# Altium schematic sheet core_module.SchDoc
size A3
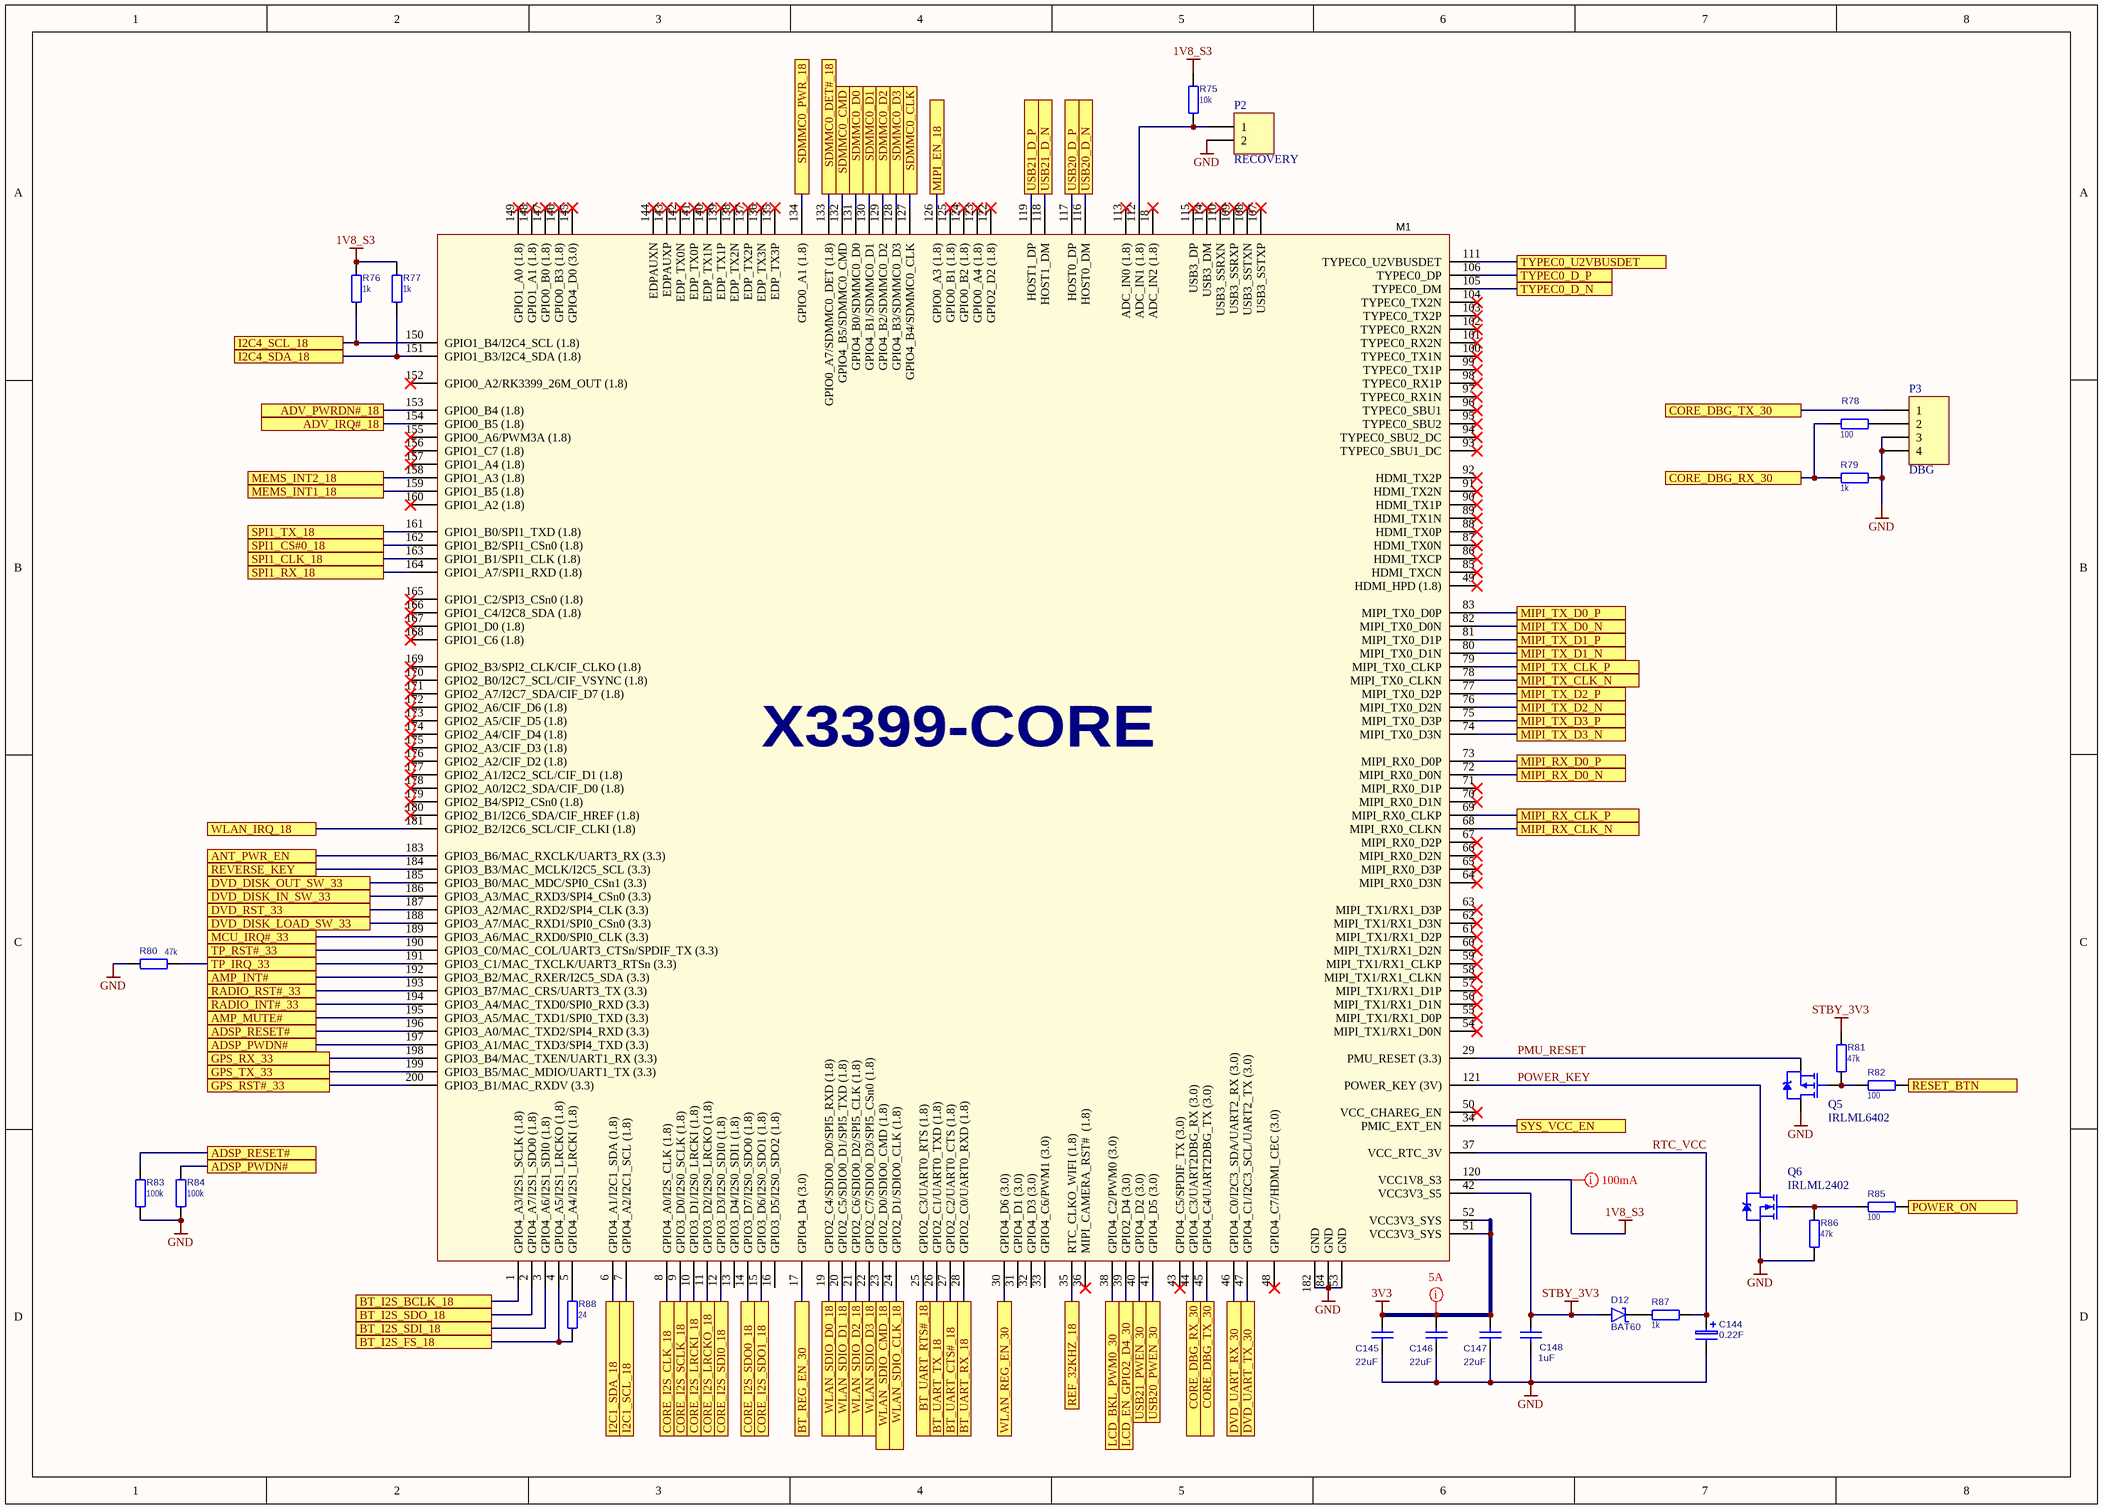
[diagram p0: core_module.SchDoc]

## Parts
C144  0.22F  [DS/DSK]
C145  value 22uF  [C0805]  (hidden comment: CL21A226MQQNNNE)
C146  value 22uF  [C0805]  (hidden comment: CL21A226MQQNNNE)
C147  value 22uF  [C0805]  (hidden comment: CL21A226MQQNNNE)
C148  value 1uF  [C0603]  (hidden comment: CC0603KRX7R9BB105)
D12  value BAT60  [SOD-323]  (hidden comment: BAT60AE6327HTSA1)
M1  X3399-CORE  [X3399-CORE]  (value not drawn)
P2  RECOVERY  [PLS-2]
P3  DBG  [PLD-2]
Q5  IRLML6402  [SOT-23-3]
Q6  IRLML2402  [SOT-23-3]
R75  10k  [R0603]
R76  1k  [R0603]
R77  1k  [R0603]
R78  100  [R0603]
R79  1k  [R0603]
R80  47k  [R0603]
R81  47k  [R0603]
R82  100  [R0603]
R83  100k  [R0603]
R84  100k  [R0603]
R85  100  [R0603]
R86  47k  [R0603]
R87  1k  [R0603]
R88  24  [R0603]

## Ports
ADSP_PWDN#, ADSP_RESET#, ADV_IRQ#_18, ADV_PWRDN#_18, AMP_INT#, AMP_MUTE#, ANT_PWR_EN, BT_I2S_BCLK_18, BT_I2S_FS_18, BT_I2S_SDI_18, BT_I2S_SDO_18, BT_REG_EN_30, BT_UART_CTS#_18, BT_UART_RTS#_18, BT_UART_RX_18, BT_UART_TX_18, CORE_DBG_RX_30, CORE_DBG_TX_30, CORE_I2S_CLK_18, CORE_I2S_LRCKI_18, CORE_I2S_LRCKO_18, CORE_I2S_SCLK_18, CORE_I2S_SDI0_18, CORE_I2S_SDO0_18, CORE_I2S_SDO1_18, DVD_DISK_IN_SW_33, DVD_DISK_LOAD_SW_33, DVD_DISK_OUT_SW_33, DVD_RST_33, DVD_UART_RX_30, DVD_UART_TX_30, GPS_RST#_33, GPS_RX_33, GPS_TX_33, I2C1_SCL_18, I2C1_SDA_18, I2C4_SCL_18, I2C4_SDA_18, LCD_BKL_PWM0_30, LCD_EN_GPIO2_D4_30, MCU_IRQ#_33, MEMS_INT1_18, MEMS_INT2_18, MIPI_EN_18, MIPI_RX_CLK_N, MIPI_RX_CLK_P, MIPI_RX_D0_N, MIPI_RX_D0_P, MIPI_TX_CLK_N, MIPI_TX_CLK_P, MIPI_TX_D0_N, MIPI_TX_D0_P, MIPI_TX_D1_N, MIPI_TX_D1_P, MIPI_TX_D2_N, MIPI_TX_D2_P, MIPI_TX_D3_N, MIPI_TX_D3_P, POWER_ON, RADIO_INT#_33, RADIO_RST#_33, REF_32KHZ_18, RESET_BTN, REVERSE_KEY, SDMMC0_CLK, SDMMC0_CMD, SDMMC0_D0, SDMMC0_D1, SDMMC0_D2, SDMMC0_D3, SDMMC0_DET#_18, SDMMC0_PWR_18, SPI1_CLK_18, SPI1_CS#0_18, SPI1_RX_18, SPI1_TX_18, SYS_VCC_EN, TP_IRQ_33, TP_RST#_33, TYPEC0_D_N, TYPEC0_D_P, TYPEC0_U2VBUSDET, USB20_D_N, USB20_D_P, USB20_PWEN_30, USB21_D_N, USB21_D_P, USB21_PWEN_30, WLAN_IRQ_18, WLAN_REG_EN_30, WLAN_SDIO_CLK_18, WLAN_SDIO_CMD_18, WLAN_SDIO_D0_18, WLAN_SDIO_D1_18, WLAN_SDIO_D2_18, WLAN_SDIO_D3_18

## Nets
1V8_S3: M1.120(VCC1V8_S3) R75.2 R76.2 R77.1
3V3: C145.1 C146.1 C147.1 M1.51(VCC3V3_SYS) M1.52(VCC3V3_SYS)
GND: C144.2(-) C145.2 C146.2 C147.2 C148.1 M1.53(GND) M1.84(GND) M1.182(GND) P2.2 P3.3 P3.4 Q5.3(D) Q6.2(S) R79.2 R80.1 R83.2 R84.2 R86.2
STBY_3V3: C148.2 D12.1(A) M1.42(VCC3V3_S5) R81.1
ADSP_PWDN#: M1.197(GPIO3_A1/MAC_TXD3/SPI4_TXD_(3.3)) R84.1 ; port ADSP_PWDN#
ADSP_RESET#: M1.196(GPIO3_A0/MAC_TXD2/SPI4_RXD_(3.3)) R83.1 ; port ADSP_RESET#
ADV_IRQ#_18: M1.154(GPIO0_B5_(1.8)) ; port ADV_IRQ#_18
ADV_PWRDN#_18: M1.153(GPIO0_B4_(1.8)) ; port ADV_PWRDN#_18
AMP_INT#: M1.192(GPIO3_B2/MAC_RXER/I2C5_SDA_(3.3)) ; port AMP_INT#
AMP_MUTE#: M1.195(GPIO3_A5/MAC_TXD1/SPI0_TXD_(3.3)) ; port AMP_MUTE#
ANT_PWR_EN: M1.183(GPIO3_B6/MAC_RXCLK/UART3_RX_(3.3)) ; port ANT_PWR_EN
BT_I2S_BCLK_18: M1.1(GPIO4_A3/I2S1_SCLK_(1.8)) ; port BT_I2S_BCLK_18
BT_I2S_FS_18: M1.4(GPIO4_A5/I2S1_LRCKO_(1.8)) R88.2 ; port BT_I2S_FS_18
BT_I2S_SDI_18: M1.3(GPIO4_A6/I2S1_SDI0_(1.8)) ; port BT_I2S_SDI_18
BT_I2S_SDO_18: M1.2(GPIO4_A7/I2S1_SDO0_(1.8)) ; port BT_I2S_SDO_18
BT_REG_EN_30: M1.17(GPIO4_D4_(3.0)) ; port BT_REG_EN_30
BT_UART_CTS#_18: M1.27(GPIO2_C2/UART0_CTS_(1.8)) ; port BT_UART_CTS#_18
BT_UART_RTS#_18: M1.25(GPIO2_C3/UART0_RTS_(1.8)) ; port BT_UART_RTS#_18
BT_UART_RX_18: M1.28(GPIO2_C0/UART0_RXD_(1.8)) ; port BT_UART_RX_18
BT_UART_TX_18: M1.26(GPIO2_C1/UART0_TXD_(1.8)) ; port BT_UART_TX_18
CORE_DBG_RX_30: M1.44(GPIO4_C3/UART2DBG_RX_(3.0)) R78.2 R79.1 ; port CORE_DBG_RX_30
CORE_DBG_TX_30: M1.45(GPIO4_C4/UART2DBG_TX_(3.0)) P3.1 ; port CORE_DBG_TX_30
CORE_I2S_CLK_18: M1.8(GPIO4_A0/I2S_CLK_(1.8)) ; port CORE_I2S_CLK_18
CORE_I2S_LRCKI_18: M1.10(GPIO3_D1/I2S0_LRCKI_(1.8)) ; port CORE_I2S_LRCKI_18
CORE_I2S_LRCKO_18: M1.11(GPIO3_D2/I2S0_LRCKO_(1.8)) ; port CORE_I2S_LRCKO_18
CORE_I2S_SCLK_18: M1.9(GPIO3_D0/I2S0_SCLK_(1.8)) ; port CORE_I2S_SCLK_18
CORE_I2S_SDI0_18: M1.12(GPIO3_D3/I2S0_SDI0_(1.8)) ; port CORE_I2S_SDI0_18
CORE_I2S_SDO0_18: M1.14(GPIO3_D7/I2S0_SDO0_(1.8)) ; port CORE_I2S_SDO0_18
CORE_I2S_SDO1_18: M1.15(GPIO3_D6/I2S0_SDO1_(1.8)) ; port CORE_I2S_SDO1_18
DVD_DISK_IN_SW_33: M1.186(GPIO3_A3/MAC_RXD3/SPI4_CSn0_(3.3)) ; port DVD_DISK_IN_SW_33
DVD_DISK_LOAD_SW_33: M1.188(GPIO3_A7/MAC_RXD1/SPI0_CSn0_(3.3)) ; port DVD_DISK_LOAD_SW_33
DVD_DISK_OUT_SW_33: M1.185(GPIO3_B0/MAC_MDC/SPI0_CSn1_(3.3)) ; port DVD_DISK_OUT_SW_33
DVD_RST_33: M1.187(GPIO3_A2/MAC_RXD2/SPI4_CLK_(3.3)) ; port DVD_RST_33
DVD_UART_RX_30: M1.46(GPIO4_C0/I2C3_SDA/UART2_RX_(3.0)) ; port DVD_UART_RX_30
DVD_UART_TX_30: M1.47(GPIO4_C1/I2C3_SCL/UART2_TX_(3.0)) ; port DVD_UART_TX_30
GPS_RST#_33: M1.200(GPIO3_B1/MAC_RXDV_(3.3)) ; port GPS_RST#_33
GPS_RX_33: M1.198(GPIO3_B4/MAC_TXEN/UART1_RX_(3.3)) ; port GPS_RX_33
GPS_TX_33: M1.199(GPIO3_B5/MAC_MDIO/UART1_TX_(3.3)) ; port GPS_TX_33
I2C1_SCL_18: M1.7(GPIO4_A2/I2C1_SCL_(1.8)) ; port I2C1_SCL_18
I2C1_SDA_18: M1.6(GPIO4_A1/I2C1_SDA_(1.8)) ; port I2C1_SDA_18
I2C4_SCL_18: M1.150(GPIO1_B4/I2C4_SCL_(1.8)) R76.1 ; port I2C4_SCL_18
I2C4_SDA_18: M1.151(GPIO1_B3/I2C4_SDA_(1.8)) R77.2 ; port I2C4_SDA_18
LCD_BKL_PWM0_30: M1.38(GPIO4_C2/PWM0_(3.0)) ; port LCD_BKL_PWM0_30
LCD_EN_GPIO2_D4_30: M1.39(GPIO2_D4_(3.0)) ; port LCD_EN_GPIO2_D4_30
MCU_IRQ#_33: M1.189(GPIO3_A6/MAC_RXD0/SPI0_CLK_(3.3)) ; port MCU_IRQ#_33
MEMS_INT1_18: M1.159(GPIO1_B5_(1.8)) ; port MEMS_INT1_18
MEMS_INT2_18: M1.158(GPIO1_A3_(1.8)) ; port MEMS_INT2_18
MIPI_EN_18: M1.126(GPIO0_A3_(1.8)) ; port MIPI_EN_18
MIPI_RX_CLK_N: M1.68(MIPI_RX0_CLKN) ; port MIPI_RX_CLK_N
MIPI_RX_CLK_P: M1.69(MIPI_RX0_CLKP) ; port MIPI_RX_CLK_P
MIPI_RX_D0_N: M1.72(MIPI_RX0_D0N) ; port MIPI_RX_D0_N
MIPI_RX_D0_P: M1.73(MIPI_RX0_D0P) ; port MIPI_RX_D0_P
MIPI_TX_CLK_N: M1.78(MIPI_TX0_CLKN) ; port MIPI_TX_CLK_N
MIPI_TX_CLK_P: M1.79(MIPI_TX0_CLKP) ; port MIPI_TX_CLK_P
MIPI_TX_D0_N: M1.82(MIPI_TX0_D0N) ; port MIPI_TX_D0_N
MIPI_TX_D0_P: M1.83(MIPI_TX0_D0P) ; port MIPI_TX_D0_P
MIPI_TX_D1_N: M1.80(MIPI_TX0_D1N) ; port MIPI_TX_D1_N
MIPI_TX_D1_P: M1.81(MIPI_TX0_D1P) ; port MIPI_TX_D1_P
MIPI_TX_D2_N: M1.76(MIPI_TX0_D2N) ; port MIPI_TX_D2_N
MIPI_TX_D2_P: M1.77(MIPI_TX0_D2P) ; port MIPI_TX_D2_P
MIPI_TX_D3_N: M1.74(MIPI_TX0_D3N) ; port MIPI_TX_D3_N
MIPI_TX_D3_P: M1.75(MIPI_TX0_D3P) ; port MIPI_TX_D3_P
PMU_RESET: M1.29(PMU_RESET_(3.3)) Q5.2(S)
POWER_KEY: M1.121(POWER_KEY_(3V)) Q6.3(D)
POWER_ON: R85.1 ; port POWER_ON
RADIO_INT#_33: M1.194(GPIO3_A4/MAC_TXD0/SPI0_RXD_(3.3)) ; port RADIO_INT#_33
RADIO_RST#_33: M1.193(GPIO3_B7/MAC_CRS/UART3_TX_(3.3)) ; port RADIO_RST#_33
REF_32KHZ_18: M1.35(RTC_CLKO_WIFI_(1.8)) ; port REF_32KHZ_18
RESET_BTN: R82.1 ; port RESET_BTN
REVERSE_KEY: M1.184(GPIO3_B3/MAC_MCLK/I2C5_SCL_(3.3)) ; port REVERSE_KEY
RTC_VCC: C144.1(+) M1.37(VCC_RTC_3V) R87.1
SDMMC0_CLK: M1.127(GPIO4_B4/SDMMC0_CLK) ; port SDMMC0_CLK
SDMMC0_CMD: M1.132(GPIO4_B5/SDMMC0_CMD) ; port SDMMC0_CMD
SDMMC0_D0: M1.131(GPIO4_B0/SDMMC0_D0) ; port SDMMC0_D0
SDMMC0_D1: M1.130(GPIO4_B1/SDMMC0_D1) ; port SDMMC0_D1
SDMMC0_D2: M1.129(GPIO4_B2/SDMMC0_D2) ; port SDMMC0_D2
SDMMC0_D3: M1.128(GPIO4_B3/SDMMC0_D3) ; port SDMMC0_D3
SDMMC0_DET#_18: M1.133(GPIO0_A7/SDMMC0_DET_(1.8)) ; port SDMMC0_DET#_18
SDMMC0_PWR_18: M1.134(GPIO0_A1_(1.8)) ; port SDMMC0_PWR_18
SPI1_CLK_18: M1.163(GPIO1_B1/SPI1_CLK_(1.8)) ; port SPI1_CLK_18
SPI1_CS#0_18: M1.162(GPIO1_B2/SPI1_CSn0_(1.8)) ; port SPI1_CS#0_18
SPI1_RX_18: M1.164(GPIO1_A7/SPI1_RXD_(1.8)) ; port SPI1_RX_18
SPI1_TX_18: M1.161(GPIO1_B0/SPI1_TXD_(1.8)) ; port SPI1_TX_18
SYS_VCC_EN: M1.34(PMIC_EXT_EN) ; port SYS_VCC_EN
TP_IRQ_33: M1.191(GPIO3_C1/MAC_TXCLK/UART3_RTSn_(3.3)) R80.2 ; port TP_IRQ_33
TP_RST#_33: M1.190(GPIO3_C0/MAC_COL/UART3_CTSn/SPDIF_TX_(3.3)) ; port TP_RST#_33
TYPEC0_D_N: M1.105(TYPEC0_DM) ; port TYPEC0_D_N
TYPEC0_D_P: M1.106(TYPEC0_DP) ; port TYPEC0_D_P
TYPEC0_U2VBUSDET: M1.111(TYPEC0_U2VBUSDET) ; port TYPEC0_U2VBUSDET
USB20_D_N: M1.116(HOST0_DM) ; port USB20_D_N
USB20_D_P: M1.117(HOST0_DP) ; port USB20_D_P
USB20_PWEN_30: M1.41(GPIO4_D5_(3.0)) ; port USB20_PWEN_30
USB21_D_N: M1.118(HOST1_DM) ; port USB21_D_N
USB21_D_P: M1.119(HOST1_DP) ; port USB21_D_P
USB21_PWEN_30: M1.40(GPIO4_D2_(3.0)) ; port USB21_PWEN_30
WLAN_IRQ_18: M1.181(GPIO2_B2/I2C6_SCL/CIF_CLKI_(1.8)) ; port WLAN_IRQ_18
WLAN_REG_EN_30: M1.30(GPIO4_D6_(3.0)) ; port WLAN_REG_EN_30
WLAN_SDIO_CLK_18: M1.24(GPIO2_D1/SDIO0_CLK_(1.8)) ; port WLAN_SDIO_CLK_18
WLAN_SDIO_CMD_18: M1.23(GPIO2_D0/SDIO0_CMD_(1.8)) ; port WLAN_SDIO_CMD_18
WLAN_SDIO_D0_18: M1.19(GPIO2_C4/SDIO0_D0/SPI5_RXD_(1.8)) ; port WLAN_SDIO_D0_18
WLAN_SDIO_D1_18: M1.20(GPIO2_C5/SDIO0_D1/SPI5_TXD_(1.8)) ; port WLAN_SDIO_D1_18
WLAN_SDIO_D2_18: M1.21(GPIO2_C6/SDIO0_D2/SPI5_CLK_(1.8)) ; port WLAN_SDIO_D2_18
WLAN_SDIO_D3_18: M1.22(GPIO2_C7/SDIO0_D3/SPI5_CSn0_(1.8)) ; port WLAN_SDIO_D3_18
NetD12_2: D12.2(K) R87.2
NetM1_5: M1.5(GPIO4_A4/I2S1_LRCKI_(1.8)) R88.1
NetM1_112: M1.112(ADC_IN1_(1.8)) P2.1 R75.1
NetP3_2: P3.2 R78.1
NetQ5_1: Q5.1(G) R81.2 R82.2
NetQ6_1: Q6.1(G) R85.2 R86.1

Not connected (* = marked no-connect by the designer): M1 13(GPIO3_D4/I2S0_SDI1_(1.8)) 16(GPIO3_D5/I2S0_SDO2_(1.8)) 18(ADC_IN2_(1.8))* 31(GPIO4_D1_(3.0)) 32(GPIO4_D3_(3.0)) 33(GPIO4_C6/PWM1_(3.0)) 36(MIPI_CAMERA_RST#__(1.8))* 43(GPIO4_C5/SPDIF_TX_(3.0))* 48(GPIO4_C7/HDMI_CEC_(3.0))* 49(HDMI_HPD_(1.8))* 50(VCC_CHAREG_EN)* 54(MIPI_TX1/RX1_D0N)* 55(MIPI_TX1/RX1_D0P)* 56(MIPI_TX1/RX1_D1N)* 57(MIPI_TX1/RX1_D1P)* 58(MIPI_TX1/RX1_CLKN)* 59(MIPI_TX1/RX1_CLKP)* 60(MIPI_TX1/RX1_D2N)* 61(MIPI_TX1/RX1_D2P)* 62(MIPI_TX1/RX1_D3N)* 63(MIPI_TX1/RX1_D3P)* 64(MIPI_RX0_D3N)* 65(MIPI_RX0_D3P)* 66(MIPI_RX0_D2N)* 67(MIPI_RX0_D2P)* 70(MIPI_RX0_D1N)* 71(MIPI_RX0_D1P)* 85(HDMI_TXCN)* 86(HDMI_TXCP)* 87(HDMI_TX0N)* 88(HDMI_TX0P)* 89(HDMI_TX1N)* 90(HDMI_TX1P)* 91(HDMI_TX2N)* 92(HDMI_TX2P)* 93(TYPEC0_SBU1_DC)* 94(TYPEC0_SBU2_DC)* 95(TYPEC0_SBU2)* 96(TYPEC0_SBU1)* 97(TYPEC0_RX1N)* 98(TYPEC0_RX1P)* 99(TYPEC0_TX1P)* 100(TYPEC0_TX1N)* 101(TYPEC0_RX2N)* 102(TYPEC0_RX2N)* 103(TYPEC0_TX2P)* 104(TYPEC0_TX2N)* 107(USB3_SSTXP)* 108(USB3_SSTXN)* 109(USB3_SSRXP)* 110(USB3_SSRXN)* 113(ADC_IN0_(1.8))* 114(USB3_DM)* 115(USB3_DP)* 122(GPIO2_D2_(1.8))* 123(GPIO0_A4_(1.8))* 124(GPIO0_B2_(1.8))* 125(GPIO0_B1_(1.8))* 135(EDP_TX3P)* 136(EDP_TX3N)* 137(EDP_TX2P)* 138(EDP_TX2N)* 139(EDP_TX1P)* 140(EDP_TX1N)* 141(EDP_TX0P)* 142(EDP_TX0N)* 143(EDPAUXP)* 144(EDPAUXN)* 145(GPIO4_D0_(3.0))* 146(GPIO0_B3_(1.8))* 147(GPIO0_B0_(1.8))* 148(GPIO1_A1_(1.8))* 149(GPIO1_A0_(1.8))* 152(GPIO0_A2/RK3399_26M_OUT_(1.8))* 155(GPIO0_A6/PWM3A_(1.8))* 156(GPIO1_C7_(1.8))* 157(GPIO1_A4_(1.8))* 160(GPIO1_A2_(1.8))* 165(GPIO1_C2/SPI3_CSn0_(1.8))* 166(GPIO1_C4/I2C8_SDA_(1.8))* 167(GPIO1_D0_(1.8))* 168(GPIO1_C6_(1.8))* 169(GPIO2_B3/SPI2_CLK/CIF_CLKO_(1.8))* 170(GPIO2_B0/I2C7_SCL/CIF_VSYNC_(1.8))* 171(GPIO2_A7/I2C7_SDA/CIF_D7_(1.8))* 172(GPIO2_A6/CIF_D6_(1.8))* 173(GPIO2_A5/CIF_D5_(1.8))* 174(GPIO2_A4/CIF_D4_(1.8))* 175(GPIO2_A3/CIF_D3_(1.8))* 176(GPIO2_A2/CIF_D2_(1.8))* 177(GPIO2_A1/I2C2_SCL/CIF_D1_(1.8))* 178(GPIO2_A0/I2C2_SDA/CIF_D0_(1.8))* 179(GPIO2_B4/SPI2_CSn0_(1.8))* 180(GPIO2_B1/I2C6_SDA/CIF_HREF_(1.8))*

## Layout directives
mark named 100mA: 1V8_S3
mark named 5A: 3V3

## Library data of the parts
C144 = CAP_POL: Value: 0.22F
C145-C148 = CAP_NPOL
D12 = SHOTTKY
M1 = X3399-CORE: RK3399 Six-Core 64-bit
P2 = HDR 2: Header, 2-Pin; LatestRevisionDate: 17-Jul-2002; LatestRevisionNote: Re-released for DXP Platform.; Publisher: Altium Limited
P3 = HDR 4: Header, 4-Pin; LatestRevisionDate: 17-Jul-2002; LatestRevisionNote: Re-released for DXP Platform.; Publisher: Altium Limited
Q5 = P-Channel: HEXFET Power MOSFET
Q6 = N-Channel: HEXFET Power MOSFET
R75-R88 = RESISTOR: RES
  R75: Value: 10k
  R76 R77 R79 R87: Value: 1k
  R78 R82 R85: Value: 100
  R80 R81 R86: Value: 47k
  R83 R84: Value: 100k
  R88: Value: 24